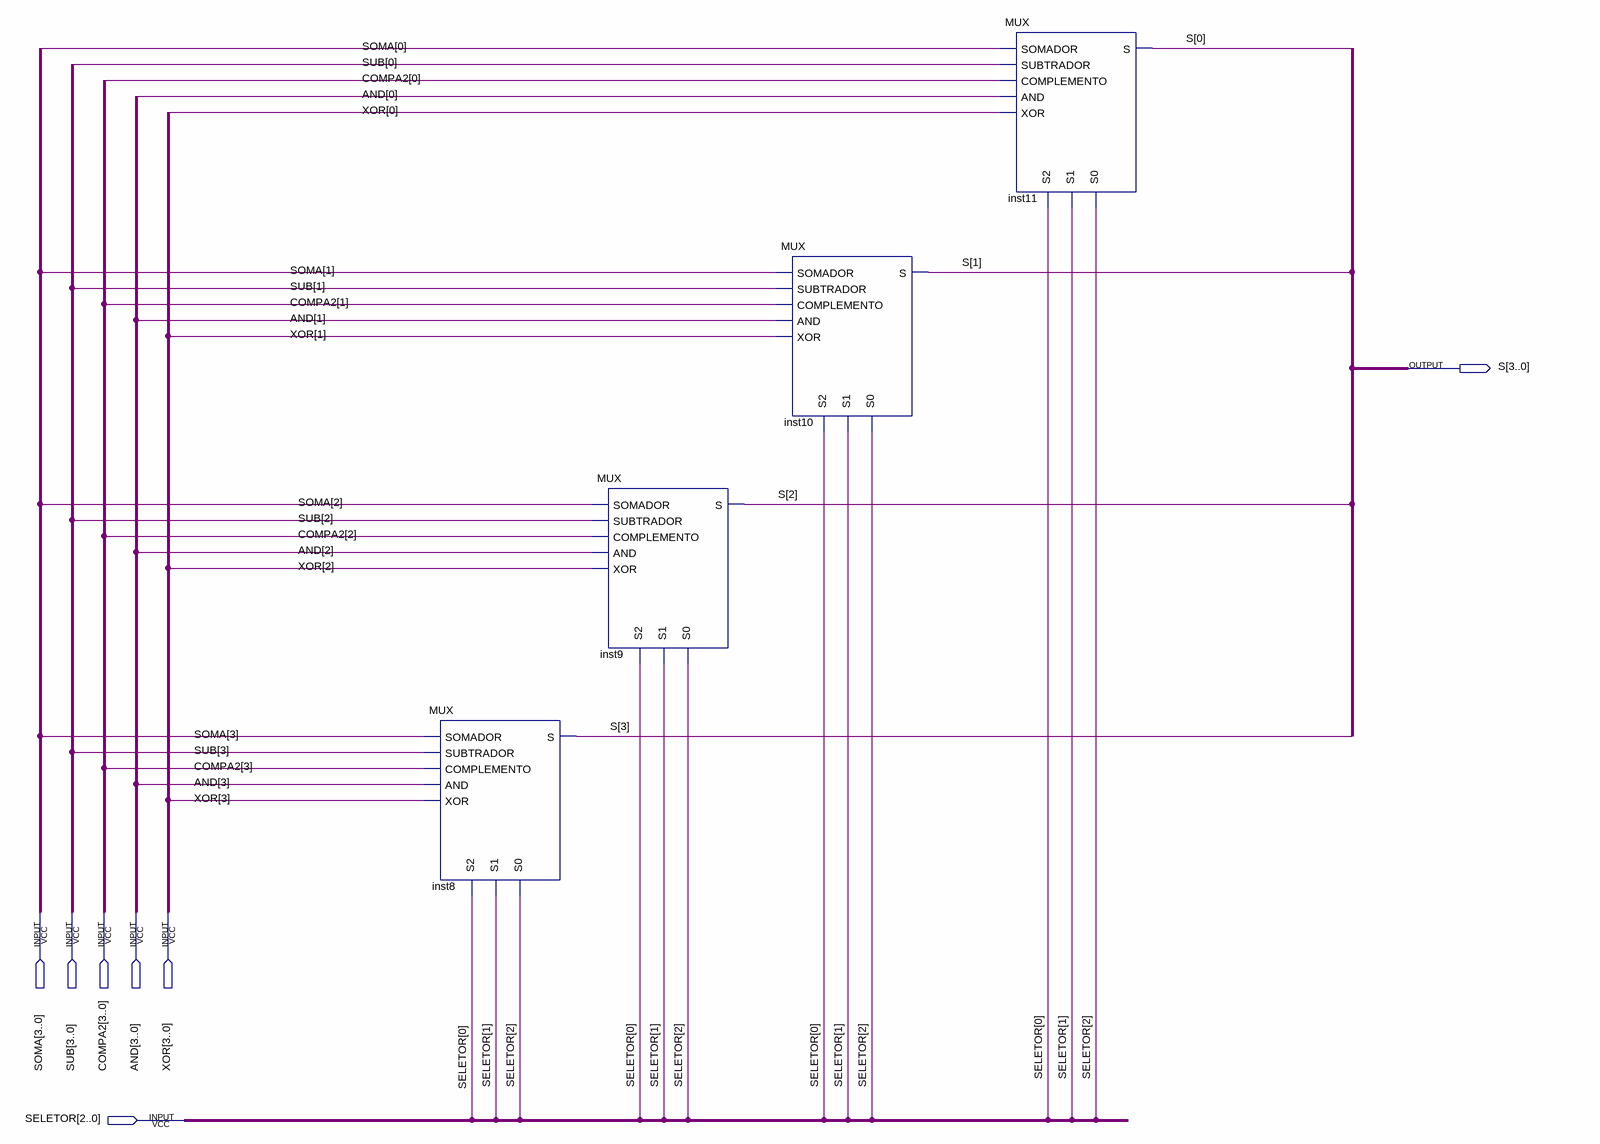
[diagram p0: schematic sheet]
// Quartus schematic MUX2.bdf as structural Verilog: 4 symbols, 7 pins
module MUX2 (
  input  [3:0] SOMA,
  input  [3:0] SUB,
  input  [3:0] COMPA2,
  input  [3:0] AND,
  input  [3:0] XOR,
  input  [2:0] SELETOR,
  output [3:0] S
);

  MUX inst8 (
    .SOMADOR(SOMA[3]), .SUBTRADOR(SUB[3]), .COMPLEMENTO(COMPA2[3]), .AND(AND[3]), .XOR(XOR[3]),
    .S2(SELETOR[0]), .S1(SELETOR[1]), .S0(SELETOR[2]), .S(S[3]));
  MUX inst9 (
    .SOMADOR(SOMA[2]), .SUBTRADOR(SUB[2]), .COMPLEMENTO(COMPA2[2]), .AND(AND[2]), .XOR(XOR[2]),
    .S2(SELETOR[0]), .S1(SELETOR[1]), .S0(SELETOR[2]), .S(S[2]));
  MUX inst10 (
    .SOMADOR(SOMA[1]), .SUBTRADOR(SUB[1]), .COMPLEMENTO(COMPA2[1]), .AND(AND[1]), .XOR(XOR[1]),
    .S2(SELETOR[0]), .S1(SELETOR[1]), .S0(SELETOR[2]), .S(S[1]));
  MUX inst11 (
    .SOMADOR(SOMA[0]), .SUBTRADOR(SUB[0]), .COMPLEMENTO(COMPA2[0]), .AND(AND[0]), .XOR(XOR[0]),
    .S2(SELETOR[0]), .S1(SELETOR[1]), .S0(SELETOR[2]), .S(S[0]));
endmodule
